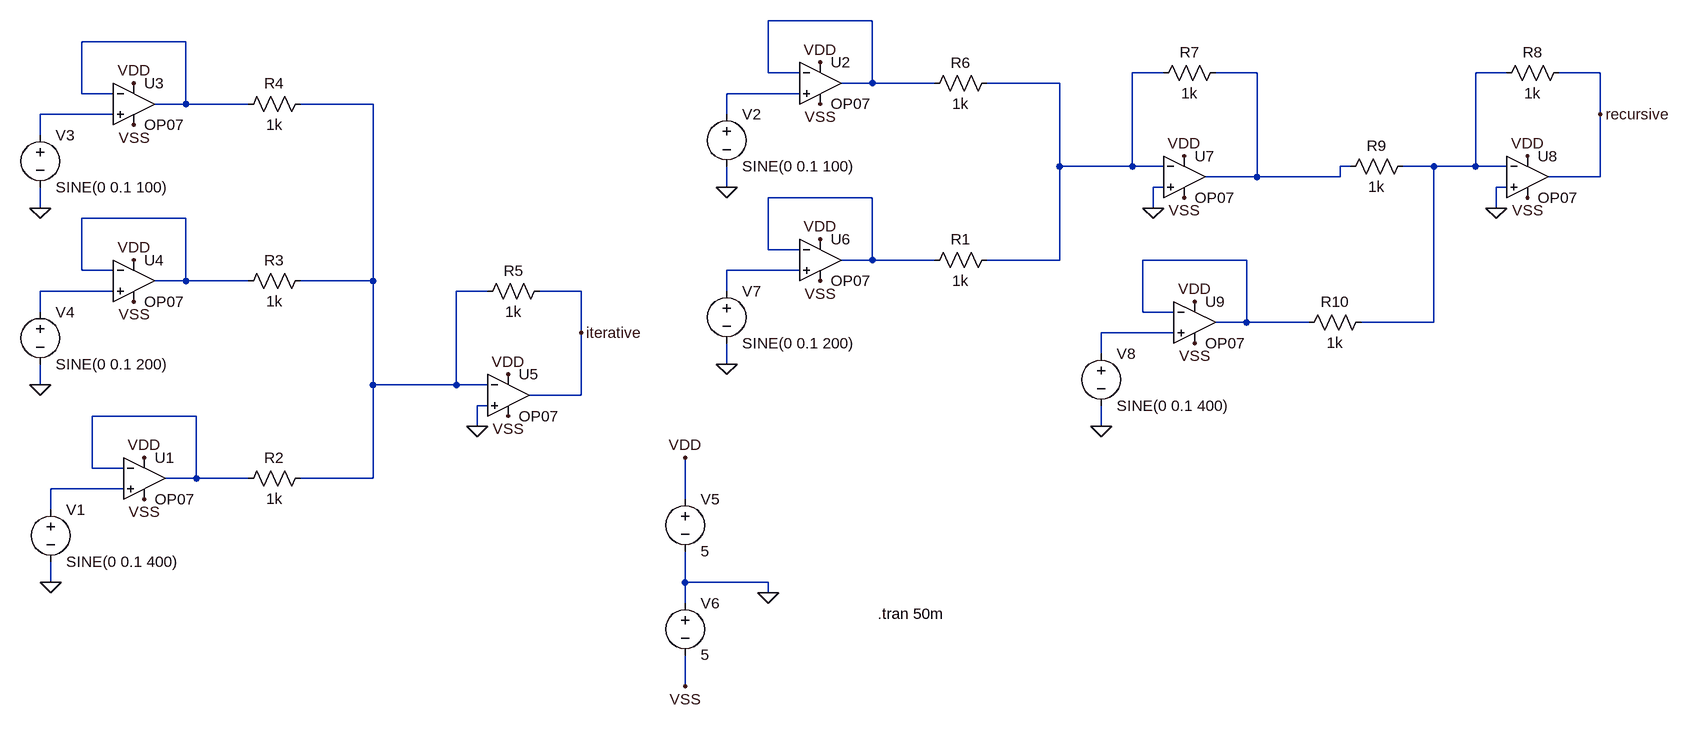
[diagram p0: schematic Voltage_Summers.asc]
Voltage_Summers.asc, the LTspice schematic file:
Version 4
SHEET 1 2436 1156
WIRE 1264 -624 1104 -624
WIRE 208 -592 48 -592
WIRE 1104 -544 1104 -624
WIRE 1152 -544 1104 -544
WIRE 1712 -544 1664 -544
WIRE 1856 -544 1792 -544
WIRE 2240 -544 2192 -544
WIRE 2384 -544 2320 -544
WIRE 1264 -528 1264 -624
WIRE 1264 -528 1216 -528
WIRE 1360 -528 1264 -528
WIRE 1552 -528 1440 -528
WIRE 48 -512 48 -592
WIRE 96 -512 48 -512
WIRE 1152 -512 1040 -512
WIRE 208 -496 208 -592
WIRE 208 -496 160 -496
WIRE 304 -496 208 -496
WIRE 496 -496 384 -496
WIRE 96 -480 -16 -480
WIRE 1040 -480 1040 -512
WIRE 2384 -480 2384 -544
WIRE -16 -448 -16 -480
WIRE 1552 -400 1552 -528
WIRE 1664 -400 1664 -544
WIRE 1664 -400 1552 -400
WIRE 1712 -400 1664 -400
WIRE 2000 -400 1984 -400
WIRE 2128 -400 2080 -400
WIRE 2192 -400 2192 -544
WIRE 2192 -400 2128 -400
WIRE 2240 -400 2192 -400
WIRE 1856 -384 1856 -544
WIRE 1856 -384 1776 -384
WIRE 1984 -384 1984 -400
WIRE 1984 -384 1856 -384
WIRE 2384 -384 2384 -480
WIRE 2384 -384 2304 -384
WIRE 1040 -368 1040 -400
WIRE 1712 -368 1696 -368
WIRE 2240 -368 2224 -368
WIRE 1264 -352 1104 -352
WIRE -16 -336 -16 -368
WIRE 1696 -336 1696 -368
WIRE 2224 -336 2224 -368
WIRE 208 -320 48 -320
WIRE 1104 -272 1104 -352
WIRE 1152 -272 1104 -272
WIRE 1264 -256 1264 -352
WIRE 1264 -256 1216 -256
WIRE 1360 -256 1264 -256
WIRE 1552 -256 1552 -400
WIRE 1552 -256 1440 -256
WIRE 1840 -256 1680 -256
WIRE 48 -240 48 -320
WIRE 96 -240 48 -240
WIRE 1152 -240 1040 -240
WIRE 208 -224 208 -320
WIRE 208 -224 160 -224
WIRE 304 -224 208 -224
WIRE 496 -224 496 -496
WIRE 496 -224 384 -224
WIRE 96 -208 -16 -208
WIRE 672 -208 624 -208
WIRE 816 -208 752 -208
WIRE 1040 -208 1040 -240
WIRE -16 -176 -16 -208
WIRE 1680 -176 1680 -256
WIRE 1728 -176 1680 -176
WIRE 1840 -160 1840 -256
WIRE 1840 -160 1792 -160
WIRE 1936 -160 1840 -160
WIRE 2128 -160 2128 -400
WIRE 2128 -160 2016 -160
WIRE 816 -144 816 -208
WIRE 1728 -144 1616 -144
WIRE 1616 -112 1616 -144
WIRE 1040 -96 1040 -128
WIRE -16 -64 -16 -96
WIRE 496 -64 496 -224
WIRE 624 -64 624 -208
WIRE 624 -64 496 -64
WIRE 672 -64 624 -64
WIRE 816 -48 816 -144
WIRE 816 -48 736 -48
WIRE 672 -32 656 -32
WIRE 224 -16 64 -16
WIRE 656 0 656 -32
WIRE 1616 0 1616 -32
WIRE 64 64 64 -16
WIRE 112 64 64 64
WIRE 224 80 224 -16
WIRE 224 80 176 80
WIRE 304 80 224 80
WIRE 496 80 496 -64
WIRE 496 80 384 80
WIRE 112 96 0 96
WIRE 976 112 976 48
WIRE 0 128 0 96
WIRE 0 240 0 208
WIRE 976 240 976 192
WIRE 1104 240 976 240
WIRE 1104 256 1104 240
WIRE 976 272 976 240
WIRE 976 400 976 352
FLAG 144 48 VDD
FLAG 144 112 VSS
FLAG 0 240 0
FLAG 128 -528 VDD
FLAG 128 -464 VSS
FLAG -16 -336 0
FLAG 128 -256 VDD
FLAG 128 -192 VSS
FLAG -16 -64 0
FLAG 1104 256 0
FLAG 976 400 VSS
FLAG 976 48 VDD
FLAG 704 -80 VDD
FLAG 704 -16 VSS
FLAG 656 0 0
FLAG 1184 -560 VDD
FLAG 1184 -496 VSS
FLAG 1040 -368 0
FLAG 1184 -288 VDD
FLAG 1184 -224 VSS
FLAG 1040 -96 0
FLAG 1744 -416 VDD
FLAG 1744 -352 VSS
FLAG 1696 -336 0
FLAG 2272 -416 VDD
FLAG 2272 -352 VSS
FLAG 2224 -336 0
FLAG 1760 -192 VDD
FLAG 1760 -128 VSS
FLAG 1616 0 0
FLAG 816 -144 iterative
FLAG 2384 -480 recursive
SYMBOL Opamps\\OP07 144 16 R0
SYMATTR InstName U1
SYMBOL voltage 0 112 R0
WINDOW 123 0 0 Left 2
WINDOW 39 0 0 Left 2
SYMATTR InstName V1
SYMATTR Value SINE(0 0.1 400)
SYMBOL Opamps\\OP07 128 -560 R0
SYMATTR InstName U3
SYMBOL voltage -16 -464 R0
WINDOW 123 0 0 Left 2
WINDOW 39 0 0 Left 2
SYMATTR InstName V3
SYMATTR Value SINE(0 0.1 100)
SYMBOL Opamps\\OP07 128 -288 R0
SYMATTR InstName U4
SYMBOL voltage -16 -192 R0
WINDOW 123 0 0 Left 2
WINDOW 39 0 0 Left 2
SYMATTR InstName V4
SYMATTR Value SINE(0 0.1 200)
SYMBOL voltage 976 96 R0
WINDOW 123 0 0 Left 2
WINDOW 39 0 0 Left 2
SYMATTR InstName V5
SYMATTR Value 5
SYMBOL voltage 976 256 R0
WINDOW 3 24 95 Left 2
WINDOW 123 0 0 Left 2
WINDOW 39 0 0 Left 2
SYMATTR InstName V6
SYMATTR Value 5
SYMBOL res 400 64 R90
WINDOW 0 0 56 VBottom 2
WINDOW 3 32 56 VTop 2
SYMATTR InstName R2
SYMATTR Value 1k
SYMBOL res 400 -240 R90
WINDOW 0 0 56 VBottom 2
WINDOW 3 32 56 VTop 2
SYMATTR InstName R3
SYMATTR Value 1k
SYMBOL res 400 -512 R90
WINDOW 0 0 56 VBottom 2
WINDOW 3 32 56 VTop 2
SYMATTR InstName R4
SYMATTR Value 1k
SYMBOL Opamps\\OP07 704 -112 R0
SYMATTR InstName U5
SYMBOL res 768 -224 R90
WINDOW 0 0 56 VBottom 2
WINDOW 3 32 56 VTop 2
SYMATTR InstName R5
SYMATTR Value 1k
SYMBOL Opamps\\OP07 1184 -592 R0
SYMATTR InstName U2
SYMBOL voltage 1040 -496 R0
WINDOW 123 0 0 Left 2
WINDOW 39 0 0 Left 2
SYMATTR InstName V2
SYMATTR Value SINE(0 0.1 100)
SYMBOL Opamps\\OP07 1184 -320 R0
SYMATTR InstName U6
SYMBOL voltage 1040 -224 R0
WINDOW 123 0 0 Left 2
WINDOW 39 0 0 Left 2
SYMATTR InstName V7
SYMATTR Value SINE(0 0.1 200)
SYMBOL res 1456 -272 R90
WINDOW 0 0 56 VBottom 2
WINDOW 3 32 56 VTop 2
SYMATTR InstName R1
SYMATTR Value 1k
SYMBOL res 1456 -544 R90
WINDOW 0 0 56 VBottom 2
WINDOW 3 32 56 VTop 2
SYMATTR InstName R6
SYMATTR Value 1k
SYMBOL Opamps\\OP07 1744 -448 R0
SYMATTR InstName U7
SYMBOL res 1808 -560 R90
WINDOW 0 0 56 VBottom 2
WINDOW 3 32 56 VTop 2
SYMATTR InstName R7
SYMATTR Value 1k
SYMBOL Opamps\\OP07 2272 -448 R0
SYMATTR InstName U8
SYMBOL res 2336 -560 R90
WINDOW 0 0 56 VBottom 2
WINDOW 3 32 56 VTop 2
SYMATTR InstName R8
SYMATTR Value 1k
SYMBOL res 2096 -416 R90
WINDOW 0 0 56 VBottom 2
WINDOW 3 32 56 VTop 2
SYMATTR InstName R9
SYMATTR Value 1k
SYMBOL Opamps\\OP07 1760 -224 R0
SYMATTR InstName U9
SYMBOL voltage 1616 -128 R0
WINDOW 123 0 0 Left 2
WINDOW 39 0 0 Left 2
SYMATTR InstName V8
SYMATTR Value SINE(0 0.1 400)
SYMBOL res 2032 -176 R90
WINDOW 0 0 56 VBottom 2
WINDOW 3 32 56 VTop 2
SYMATTR InstName R10
SYMATTR Value 1k
TEXT 1272 288 Left 2 !.tran 50m

The netlist it stands for:
* Voltage_Summers.asc
XU1 N016 N015 VDD VSS N015 LT1001  ; OP07, pins In+ In- V+ V- OUT
V1 N016 0 SINE(0 0.1 400)
XU3 N008 N002 VDD VSS N002 LT1001  ; OP07, pins In+ In- V+ V- OUT
V3 N008 0 SINE(0 0.1 100)
XU4 N013 N010 VDD VSS N010 LT1001  ; OP07, pins In+ In- V+ V- OUT
V4 N013 0 SINE(0 0.1 200)
V5 VDD 0 5
V6 0 VSS 5
R2 N007 N015 1k
R3 N007 N010 1k
R4 N007 N002 1k
XU5 0 N007 VDD VSS iterative LT1001  ; OP07, pins In+ In- V+ V- OUT
R5 iterative N007 1k
XU2 N006 N001 VDD VSS N001 LT1001  ; OP07, pins In+ In- V+ V- OUT
V2 N006 0 SINE(0 0.1 100)
XU6 N012 N009 VDD VSS N009 LT1001  ; OP07, pins In+ In- V+ V- OUT
V7 N012 0 SINE(0 0.1 200)
R1 N003 N009 1k
R6 N003 N001 1k
XU7 0 N003 VDD VSS N004 LT1001  ; OP07, pins In+ In- V+ V- OUT
R7 N004 N003 1k
XU8 0 N005 VDD VSS recursive LT1001  ; OP07, pins In+ In- V+ V- OUT
R8 recursive N005 1k
R9 N005 N004 1k
XU9 N014 N011 VDD VSS N011 LT1001  ; OP07, pins In+ In- V+ V- OUT
V8 N014 0 SINE(0 0.1 400)
R10 N005 N011 1k
.tran 50m
.lib LTC.lib
.backanno
.end